# Altium schematic sheet TI_MAIN.SchDoc
size A0
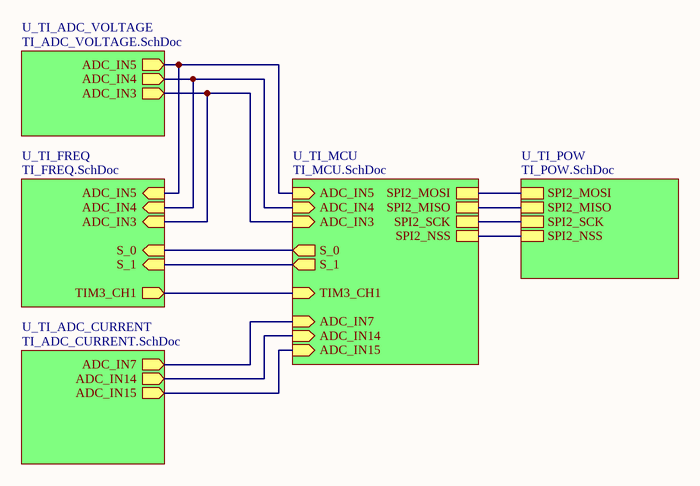
[diagram p0: TI_MAIN.SchDoc]

## Sub-sheets
U_TI_ADC_CURRENT = TI_ADC_CURRENT.SchDoc: ADC_IN15 (out), ADC_IN7 (out), ADC_IN14 (out)
U_TI_ADC_VOLTAGE = TI_ADC_VOLTAGE.SchDoc: ADC_IN5 (out), ADC_IN3 (out), ADC_IN4 (out)
U_TI_FREQ = TI_FREQ.SchDoc: ADC_IN5 (in), ADC_IN3 (in), ADC_IN4 (in), S_0 (in), S_1 (in), TIM3_CH1 (out)
U_TI_MCU = TI_MCU.SchDoc: SPI2_MOSI, SPI2_MISO, SPI2_SCK, SPI2_NSS, ADC_IN14 (in), TIM3_CH1 (in), ADC_IN15 (in), ADC_IN5 (in), ADC_IN7 (in), ADC_IN3 (in), ADC_IN4 (in), S_0 (out), S_1 (out)
U_TI_POW = TI_POW.SchDoc: SPI2_MOSI, SPI2_MISO, SPI2_SCK, SPI2_NSS

## Nets
(unnamed): sheet U_TI_MCU/SPI2_MOSI, sheet U_TI_POW/SPI2_MOSI
(unnamed): sheet U_TI_MCU/SPI2_MISO, sheet U_TI_POW/SPI2_MISO
(unnamed): sheet U_TI_MCU/SPI2_SCK, sheet U_TI_POW/SPI2_SCK
(unnamed): sheet U_TI_MCU/SPI2_NSS, sheet U_TI_POW/SPI2_NSS
(unnamed): sheet U_TI_MCU/ADC_IN14, sheet U_TI_ADC_CURRENT/ADC_IN14
(unnamed): sheet U_TI_MCU/TIM3_CH1, sheet U_TI_FREQ/TIM3_CH1
(unnamed): sheet U_TI_MCU/ADC_IN15, sheet U_TI_ADC_CURRENT/ADC_IN15
(unnamed): sheet U_TI_MCU/ADC_IN5, sheet U_TI_ADC_VOLTAGE/ADC_IN5, sheet U_TI_FREQ/ADC_IN5
(unnamed): sheet U_TI_MCU/ADC_IN7, sheet U_TI_ADC_CURRENT/ADC_IN7
(unnamed): sheet U_TI_MCU/ADC_IN3, sheet U_TI_ADC_VOLTAGE/ADC_IN3, sheet U_TI_FREQ/ADC_IN3
(unnamed): sheet U_TI_MCU/ADC_IN4, sheet U_TI_ADC_VOLTAGE/ADC_IN4, sheet U_TI_FREQ/ADC_IN4
(unnamed): sheet U_TI_MCU/S_0, sheet U_TI_FREQ/S_0
(unnamed): sheet U_TI_MCU/S_1, sheet U_TI_FREQ/S_1